# Altium schematic sheet SUMMARY.SchDoc: Summary
size A4; Author: João Guimarães; Revision: 1.0; SheetNumber: 1; SheetTotal: 7; Project: Automotive Network EVB; PCB: MainBoard; Version: 1.0.0
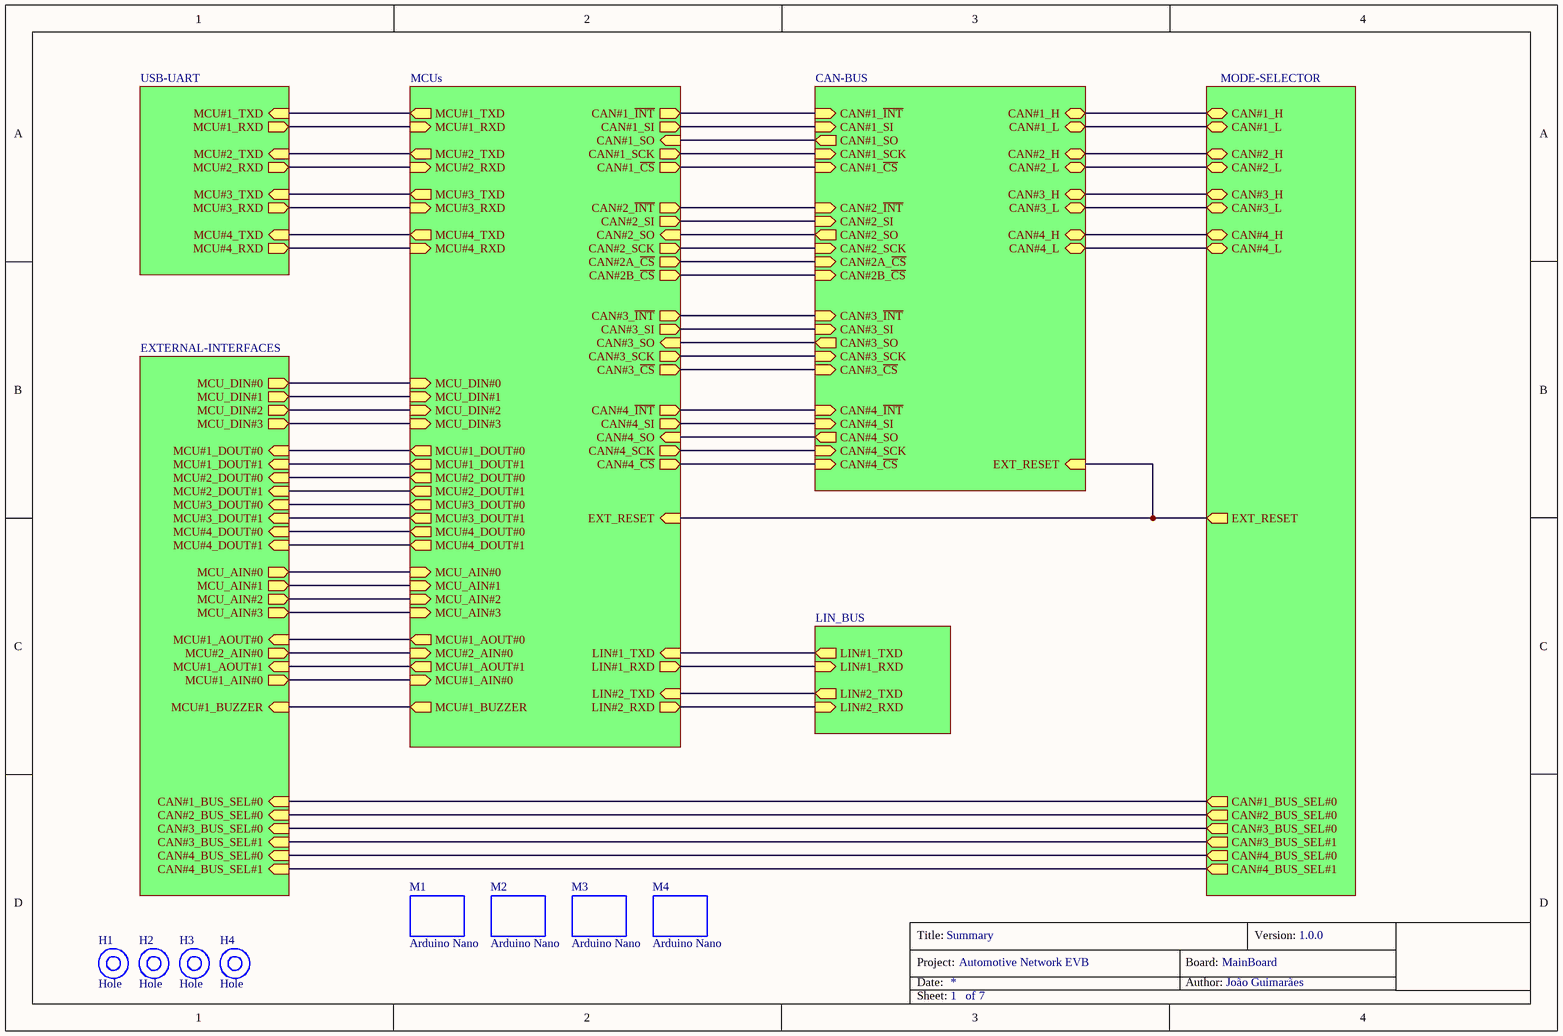
[diagram p0: SUMMARY.SchDoc]

## Parts
H1  Hole  [MISC-HOLE-3.5MM/6.6MM]
H2  Hole  [MISC-HOLE-3.5MM/6.6MM]
H3  Hole  [MISC-HOLE-3.5MM/6.6MM]
H4  Hole  [MISC-HOLE-3.5MM/6.6MM]
M1  Arduino Nano  [MEC-Arduino-Nano]
M2  Arduino Nano  [MEC-Arduino-Nano]
M3  Arduino Nano  [MEC-Arduino-Nano]
M4  Arduino Nano  [MEC-Arduino-Nano]

## Sub-sheets
CAN-BUS = CAN-BUS.SchDoc: CAN#1_~{INT} (in), CAN#1_SI (in), CAN#1_SO (out), CAN#1_SCK (in), CAN#2_~{INT} (in), CAN#2_SI (in), CAN#2_SO (out), CAN#2_SCK (in), CAN#3_~{INT} (in), CAN#2A_~{CS} (in), CAN#2B_~{CS} (in), CAN#3_SI (in), CAN#3_SO (out), CAN#3_SCK (in), CAN#3_~{CS} (in), CAN#4_~{INT} (in), CAN#4_SI (in), CAN#4_SO (out), CAN#4_SCK (in), CAN#4_~{CS} (in), CAN#1_H (bidir), CAN#1_L (bidir), CAN#2_H (bidir), CAN#2_L (bidir), CAN#3_H (bidir), CAN#3_L (bidir), CAN#4_H (bidir), CAN#4_L (bidir), EXT_RESET (in), CAN#1_~{CS} (in)
EXTERNAL-INTERFACES = EXTERNAL-INTERFACES.SchDoc: MCU_DIN#0 (out), MCU#1_DOUT#0 (in), MCU_AIN#0 (out), MCU_DIN#1 (out), MCU_DIN#2 (out), MCU_DIN#3 (out), MCU_AIN#1 (out), MCU_AIN#2 (out), MCU_AIN#3 (out), MCU#1_AOUT#0 (in), MCU#2_AIN#0 (out), MCU#1_AOUT#1 (in), MCU#1_BUZZER (in), MCU#1_DOUT#1 (in), MCU#2_DOUT#0 (in), MCU#2_DOUT#1 (in), MCU#3_DOUT#0 (in), MCU#3_DOUT#1 (in), MCU#4_DOUT#0 (in), MCU#4_DOUT#1 (in), CAN#4_BUS_SEL#1 (in), CAN#4_BUS_SEL#0 (in), CAN#3_BUS_SEL#1 (in), CAN#3_BUS_SEL#0 (in), CAN#2_BUS_SEL#0 (in), CAN#1_BUS_SEL#0 (in), MCU#1_AIN#0 (out)
LIN_BUS = LIN-BUS.SchDoc: LIN#1_TXD (out), LIN#1_RXD (in), LIN#2_TXD (out), LIN#2_RXD (in)
MCUs = MCUs.SchDoc: CAN#1_~{INT} (out), CAN#1_~{CS} (out), CAN#1_SI (out), CAN#1_SO (in), CAN#1_SCK (out), CAN#2_~{INT} (out), CAN#2A_~{CS} (out), CAN#2_SI (out), CAN#2_SO (in), CAN#2_SCK (out), CAN#3_~{INT} (out), CAN#3_~{CS} (out), CAN#3_SI (out), CAN#3_SO (in), CAN#3_SCK (out), CAN#4_~{INT} (out), CAN#4_~{CS} (out), CAN#4_SI (out), CAN#4_SO (in), CAN#4_SCK (out), CAN#2B_~{CS} (out), MCU#1_TXD (out), MCU#1_RXD (in), MCU#2_TXD (out), MCU#3_TXD (out), MCU#4_TXD (out), MCU#2_RXD (in), MCU#3_RXD (in), MCU#4_RXD (in), MCU_DIN#0 (in), MCU_DIN#1 (in), MCU_DIN#2 (in), MCU_DIN#3 (in), LIN#1_TXD (in), LIN#1_RXD (out), LIN#2_TXD (in), LIN#2_RXD (out), MCU#1_DOUT#0 (out), MCU#1_DOUT#1 (out), MCU#2_DOUT#0 (out), MCU#2_DOUT#1 (out), MCU#3_DOUT#0 (out), MCU#3_DOUT#1 (out), MCU#4_DOUT#0 (out), MCU#4_DOUT#1 (out), MCU_AIN#0 (in), MCU_AIN#1 (in), MCU_AIN#2 (in), MCU_AIN#3 (in), MCU#1_AOUT#0 (out), MCU#2_AIN#0 (in), MCU#1_AOUT#1 (out), MCU#1_AIN#0 (in), MCU#1_BUZZER (out), EXT_RESET (in)
MODE-SELECTOR = MODE-SELECTOR.SchDoc: CAN#1_H (bidir), CAN#1_L (bidir), CAN#2_H (bidir), CAN#2_L (bidir), CAN#3_H (bidir), CAN#3_L (bidir), CAN#4_H (bidir), CAN#4_L (bidir), CAN#4_BUS_SEL#1 (out), CAN#4_BUS_SEL#0 (out), CAN#3_BUS_SEL#1 (out), CAN#3_BUS_SEL#0 (out), CAN#2_BUS_SEL#0 (out), CAN#1_BUS_SEL#0 (out), EXT_RESET (out)
USB-UART = USB-UART.SchDoc: MCU#1_TXD (in), MCU#1_RXD (out), MCU#2_TXD (in), MCU#2_RXD (out), MCU#3_TXD (in), MCU#3_RXD (out), MCU#4_TXD (in), MCU#4_RXD (out)

## Nets
(unnamed): sheet MCUs/CAN#1_~{INT}, sheet CAN-BUS/CAN#1_~{INT}
(unnamed): sheet MCUs/CAN#1_~{CS}, sheet CAN-BUS/CAN#1_~{CS}
(unnamed): sheet MCUs/CAN#1_SI, sheet CAN-BUS/CAN#1_SI
(unnamed): sheet MCUs/CAN#1_SO, sheet CAN-BUS/CAN#1_SO
(unnamed): sheet MCUs/CAN#1_SCK, sheet CAN-BUS/CAN#1_SCK
(unnamed): sheet MCUs/CAN#2_~{INT}, sheet CAN-BUS/CAN#2_~{INT}
(unnamed): sheet MCUs/CAN#2A_~{CS}, sheet CAN-BUS/CAN#2A_~{CS}
(unnamed): sheet MCUs/CAN#2_SI, sheet CAN-BUS/CAN#2_SI
(unnamed): sheet MCUs/CAN#2_SO, sheet CAN-BUS/CAN#2_SO
(unnamed): sheet MCUs/CAN#2_SCK, sheet CAN-BUS/CAN#2_SCK
(unnamed): sheet MCUs/CAN#3_~{INT}, sheet CAN-BUS/CAN#3_~{INT}
(unnamed): sheet MCUs/CAN#3_~{CS}, sheet CAN-BUS/CAN#3_~{CS}
(unnamed): sheet MCUs/CAN#3_SI, sheet CAN-BUS/CAN#3_SI
(unnamed): sheet MCUs/CAN#3_SO, sheet CAN-BUS/CAN#3_SO
(unnamed): sheet MCUs/CAN#3_SCK, sheet CAN-BUS/CAN#3_SCK
(unnamed): sheet MCUs/CAN#4_~{INT}, sheet CAN-BUS/CAN#4_~{INT}
(unnamed): sheet MCUs/CAN#4_~{CS}, sheet CAN-BUS/CAN#4_~{CS}
(unnamed): sheet MCUs/CAN#4_SI, sheet CAN-BUS/CAN#4_SI
(unnamed): sheet MCUs/CAN#4_SO, sheet CAN-BUS/CAN#4_SO
(unnamed): sheet MCUs/CAN#4_SCK, sheet CAN-BUS/CAN#4_SCK
(unnamed): sheet MCUs/CAN#2B_~{CS}, sheet CAN-BUS/CAN#2B_~{CS}
(unnamed): sheet MCUs/MCU#1_TXD, sheet USB-UART/MCU#1_TXD
(unnamed): sheet MCUs/MCU#1_RXD, sheet USB-UART/MCU#1_RXD
(unnamed): sheet MCUs/MCU#2_TXD, sheet USB-UART/MCU#2_TXD
(unnamed): sheet MCUs/MCU#3_TXD, sheet USB-UART/MCU#3_TXD
(unnamed): sheet MCUs/MCU#4_TXD, sheet USB-UART/MCU#4_TXD
(unnamed): sheet MCUs/MCU#2_RXD, sheet USB-UART/MCU#2_RXD
(unnamed): sheet MCUs/MCU#3_RXD, sheet USB-UART/MCU#3_RXD
(unnamed): sheet MCUs/MCU#4_RXD, sheet USB-UART/MCU#4_RXD
(unnamed): sheet MCUs/MCU_DIN#0, sheet EXTERNAL-INTERFACES/MCU_DIN#0
(unnamed): sheet MCUs/MCU_DIN#1, sheet EXTERNAL-INTERFACES/MCU_DIN#1
(unnamed): sheet MCUs/MCU_DIN#2, sheet EXTERNAL-INTERFACES/MCU_DIN#2
(unnamed): sheet MCUs/MCU_DIN#3, sheet EXTERNAL-INTERFACES/MCU_DIN#3
(unnamed): sheet MCUs/LIN#1_TXD, sheet LIN_BUS/LIN#1_TXD
(unnamed): sheet MCUs/LIN#1_RXD, sheet LIN_BUS/LIN#1_RXD
(unnamed): sheet MCUs/LIN#2_TXD, sheet LIN_BUS/LIN#2_TXD
(unnamed): sheet MCUs/LIN#2_RXD, sheet LIN_BUS/LIN#2_RXD
(unnamed): sheet MCUs/MCU#1_DOUT#0, sheet EXTERNAL-INTERFACES/MCU#1_DOUT#0
(unnamed): sheet MCUs/MCU#1_DOUT#1, sheet EXTERNAL-INTERFACES/MCU#1_DOUT#1
(unnamed): sheet MCUs/MCU#2_DOUT#0, sheet EXTERNAL-INTERFACES/MCU#2_DOUT#0
(unnamed): sheet MCUs/MCU#2_DOUT#1, sheet EXTERNAL-INTERFACES/MCU#2_DOUT#1
(unnamed): sheet MCUs/MCU#3_DOUT#0, sheet EXTERNAL-INTERFACES/MCU#3_DOUT#0
(unnamed): sheet MCUs/MCU#3_DOUT#1, sheet EXTERNAL-INTERFACES/MCU#3_DOUT#1
(unnamed): sheet MCUs/MCU#4_DOUT#0, sheet EXTERNAL-INTERFACES/MCU#4_DOUT#0
(unnamed): sheet MCUs/MCU#4_DOUT#1, sheet EXTERNAL-INTERFACES/MCU#4_DOUT#1
(unnamed): sheet MCUs/MCU_AIN#0, sheet EXTERNAL-INTERFACES/MCU_AIN#0
(unnamed): sheet MCUs/MCU_AIN#1, sheet EXTERNAL-INTERFACES/MCU_AIN#1
(unnamed): sheet MCUs/MCU_AIN#2, sheet EXTERNAL-INTERFACES/MCU_AIN#2
(unnamed): sheet MCUs/MCU_AIN#3, sheet EXTERNAL-INTERFACES/MCU_AIN#3
(unnamed): sheet MCUs/MCU#1_AOUT#0, sheet EXTERNAL-INTERFACES/MCU#1_AOUT#0
(unnamed): sheet MCUs/MCU#2_AIN#0, sheet EXTERNAL-INTERFACES/MCU#2_AIN#0
(unnamed): sheet MCUs/MCU#1_AOUT#1, sheet EXTERNAL-INTERFACES/MCU#1_AOUT#1
(unnamed): sheet MCUs/MCU#1_AIN#0, sheet EXTERNAL-INTERFACES/MCU#1_AIN#0
(unnamed): sheet MCUs/MCU#1_BUZZER, sheet EXTERNAL-INTERFACES/MCU#1_BUZZER
(unnamed): sheet MCUs/EXT_RESET, sheet CAN-BUS/EXT_RESET, sheet MODE-SELECTOR/EXT_RESET
(unnamed): sheet CAN-BUS/CAN#1_H, sheet MODE-SELECTOR/CAN#1_H
(unnamed): sheet CAN-BUS/CAN#1_L, sheet MODE-SELECTOR/CAN#1_L
(unnamed): sheet CAN-BUS/CAN#2_H, sheet MODE-SELECTOR/CAN#2_H
(unnamed): sheet CAN-BUS/CAN#2_L, sheet MODE-SELECTOR/CAN#2_L
(unnamed): sheet CAN-BUS/CAN#3_H, sheet MODE-SELECTOR/CAN#3_H
(unnamed): sheet CAN-BUS/CAN#3_L, sheet MODE-SELECTOR/CAN#3_L
(unnamed): sheet CAN-BUS/CAN#4_H, sheet MODE-SELECTOR/CAN#4_H
(unnamed): sheet CAN-BUS/CAN#4_L, sheet MODE-SELECTOR/CAN#4_L
(unnamed): sheet EXTERNAL-INTERFACES/CAN#4_BUS_SEL#1, sheet MODE-SELECTOR/CAN#4_BUS_SEL#1
(unnamed): sheet EXTERNAL-INTERFACES/CAN#4_BUS_SEL#0, sheet MODE-SELECTOR/CAN#4_BUS_SEL#0
(unnamed): sheet EXTERNAL-INTERFACES/CAN#3_BUS_SEL#1, sheet MODE-SELECTOR/CAN#3_BUS_SEL#1
(unnamed): sheet EXTERNAL-INTERFACES/CAN#3_BUS_SEL#0, sheet MODE-SELECTOR/CAN#3_BUS_SEL#0
(unnamed): sheet EXTERNAL-INTERFACES/CAN#2_BUS_SEL#0, sheet MODE-SELECTOR/CAN#2_BUS_SEL#0
(unnamed): sheet EXTERNAL-INTERFACES/CAN#1_BUS_SEL#0, sheet MODE-SELECTOR/CAN#1_BUS_SEL#0

## Notes on the sheet
- Title:
- Project:
- Date:
- Author:
- Board:
- Version:
- Sheet:
- of

## Library data of the parts
M1-M4 = Arduino Nano Mechanical